# Altium schematic sheet testtest.SchDoc
size A4; SheetNumber: 2; SheetTotal: 2
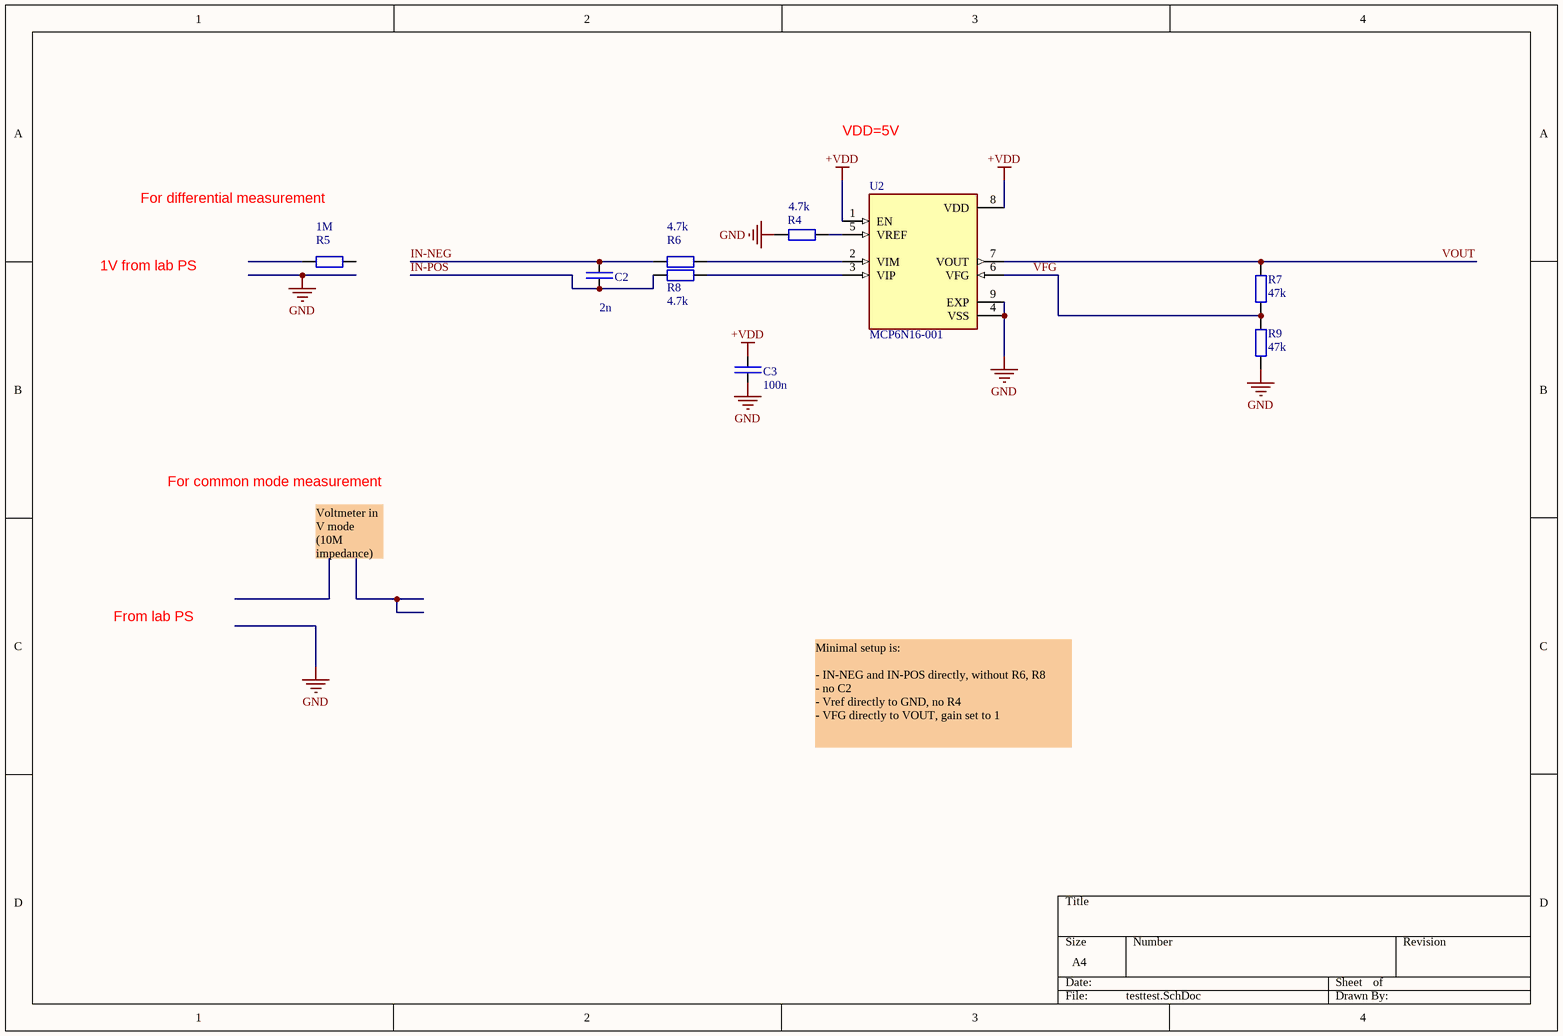
[diagram p0: testtest.SchDoc]

## Parts
C2  value 2n  [FPR_0402_C_R0]  (hidden comment: PN_C_100n)
C3  value 100n  [FPR_0402_C_R0]  (hidden comment: PN_C_100n)
R4  value 4.7k  [FPR_0402_R_R0]  (hidden comment: PN_R_4k7)
R5  value 1M  [FPR_0402_R_R0]  (hidden comment: PN_R_4k7)
R6  value 4.7k  [FPR_0402_R_R0]  (hidden comment: PN_R_4k7)
R7  value 47k  [FPR_0402_R_R0]  (hidden comment: PN_R_4k7)
R8  value 4.7k  [FPR_0402_R_R0]  (hidden comment: PN_R_4k7)
R9  value 47k  [FPR_0402_R_R0]  (hidden comment: PN_R_4k7)
U2  MCP6N16-001  [SON65P300X300X100-9N]

## Nets
+VDD: C3.2 U2.1(EN) U2.8(VDD)
GND: C3.1 R4.2 R9.2 U2.4(VSS) U2.9(EXP)
IN-NEG: C2.2 R6.2
IN-POS: C2.1 R8.2
VFG: R7.2 R9.1 U2.6(VFG)
VOUT: R7.1 U2.7(VOUT)
NetR4_1: R4.1 U2.5(VREF)
NetR6_1: R6.1 U2.2(VIM)
NetR8_1: R8.1 U2.3(VIP)

Not connected (* = marked no-connect by the designer): R5 1 2

## Notes on the sheet
- VDD=5V
- For differential measurement
- 1V from lab PS
- For common mode measurement
- Voltmeter in V mode (10M impedance)
- From lab PS
- Minimal setup is:
  - IN-NEG and IN-POS directly, without R6, R8
  - no C2
  - Vref directly to GND, no R4
  - VFG directly to VOUT, gain set to 1

## Library data of the parts
C2 C3 = C: Capacitor - generic SMD
R4-R9 = R: Resistor - generic SMD
U2 = MCP6N16-100E/MF: Instrumentation Amplifier 1 Circuit Rail-to-Rail 8-DFN-EP (3x3); MF: Microchip; MP: MCP6N16-100E/MF; Package: DFN-8 Microchip; Availability: In Stock; Price: None; Purchase-URL: https://pricing.snapeda.com/search/part/MCP6N16-100E/MF/?ref=eda; Check_prices: https://www.snapeda.com/parts/MCP6N16-100E/MF/Microchip/view-part/?ref=eda; SnapEDA_Link: https://www.snapeda.com/parts/MCP6N16-100E/MF/Microchip/view-part/?ref=snap; Value: *